# Altium schematic sheet S7CAS-PLEIADES-CARTE-MERE_P02_POWER.SchDoc
size Tabloid; DocumentNumber: 2; SheetNumber: 2; SheetTotal: 14; Size: 11x17; Sheet_Name: Alimentation connecteur FMC
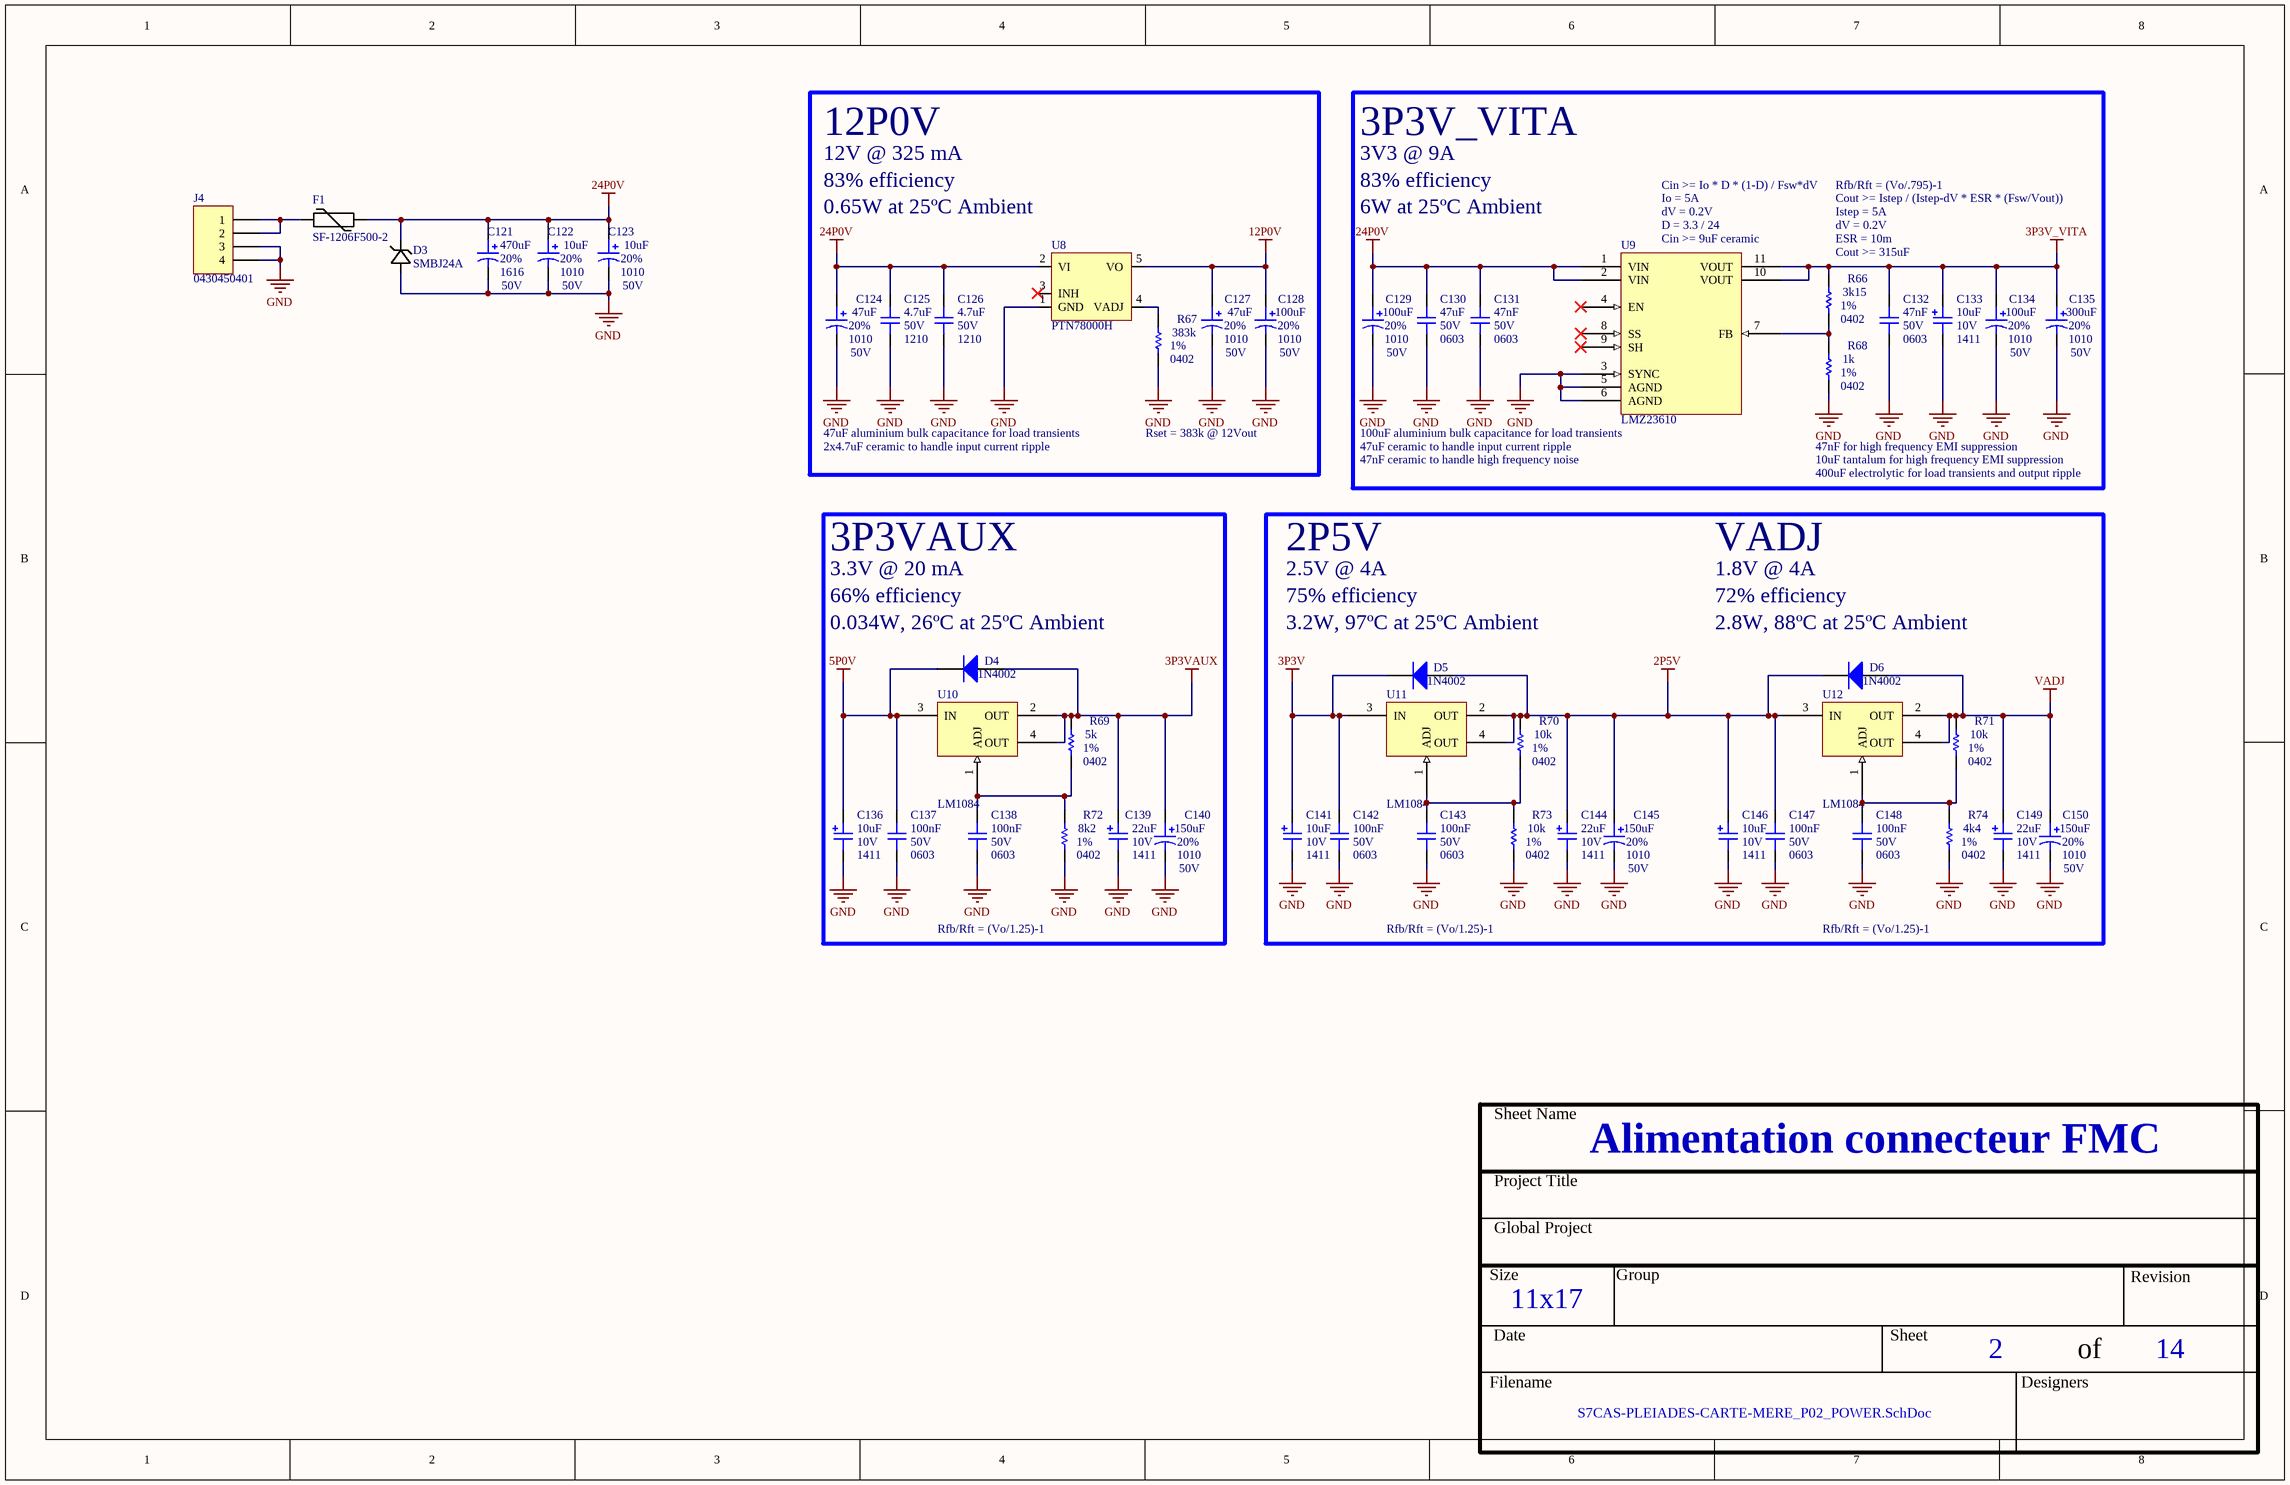
[diagram p0: S7CAS-PLEIADES-CARTE-MERE_P02_POWER.SchDoc]

## Parts
C121  value 470uF  Voltage: 50V  Package: 1616  Precision: 20%  [CAP_ALU_1616_vishay]  (hidden comment: MAL214699108E3)
C122  value 10uF  Voltage: 50V  Package: 1010  Precision: 20%  [CAP_ALU_1010_vishay]  (hidden comment: MAL215099101E3)
C123  value 10uF  Voltage: 50V  Package: 1010  Precision: 20%  [CAP_ALU_1010_vishay]  (hidden comment: MAL215099101E3)
C124  value 47uF  Voltage: 50V  Package: 1010  Precision: 20%  [CAP_ALU_1010_vishay]  (hidden comment: MAL215099101E3)
C125  value 4.7uF  Voltage: 50V  Package: 1210  [CAP_1210]  (hidden comment: CAP - 1210)
C126  value 4.7uF  Voltage: 50V  Package: 1210  [CAP_1210]  (hidden comment: CAP - 1210)
C127  value 47uF  Voltage: 50V  Package: 1010  Precision: 20%  [CAP_ALU_1010_vishay]  (hidden comment: MAL215099101E3)
C128  value 100uF  Voltage: 50V  Package: 1010  Precision: 20%  [CAP_ALU_1010_vishay]  (hidden comment: MAL215099101E3)
C129  value 100uF  Voltage: 50V  Package: 1010  Precision: 20%  [CAP_ALU_1010_vishay]  (hidden comment: MAL215099101E3)
C130  value 47uF  Voltage: 50V  Package: 0603  [CAP_0603]  (hidden comment: CAP - 0603)
C131  value 47nF  Voltage: 50V  Package: 0603  [CAP_0603]  (hidden comment: CAP - 0603)
C132  value 47nF  Voltage: 50V  Package: 0603  [CAP_0603]  (hidden comment: CAP - 0603)
C133  value 10uF  Voltage: 10V  Package: 1411  [CAP_TAN_1411(B)]  (hidden comment: CAP - TANTALUM - CASE B)
C134  value 100uF  Voltage: 50V  Package: 1010  Precision: 20%  [CAP_ALU_1010_vishay]  (hidden comment: MAL215099101E3)
C135  value 300uF  Voltage: 50V  Package: 1010  Precision: 20%  [CAP_ALU_1010_vishay]  (hidden comment: MAL215099101E3)
C136  value 10uF  Voltage: 10V  Package: 1411  [CAP_TAN_1411(B)]  (hidden comment: CAP - TANTALUM - CASE B)
C137  value 100nF  Voltage: 50V  Package: 0603  [CAP_0603]  (hidden comment: CAP - 0603)
C138  value 100nF  Voltage: 50V  Package: 0603  [CAP_0603]  (hidden comment: CAP - 0603)
C139  value 22uF  Voltage: 10V  Package: 1411  [CAP_TAN_1411(B)]  (hidden comment: CAP - TANTALUM - CASE B)
C140  value 150uF  Voltage: 50V  Package: 1010  Precision: 20%  [CAP_ALU_1010_vishay]  (hidden comment: MAL215099101E3)
C141  value 10uF  Voltage: 10V  Package: 1411  [CAP_TAN_1411(B)]  (hidden comment: CAP - TANTALUM - CASE B)
C142  value 100nF  Voltage: 50V  Package: 0603  [CAP_0603]  (hidden comment: CAP - 0603)
C143  value 100nF  Voltage: 50V  Package: 0603  [CAP_0603]  (hidden comment: CAP - 0603)
C144  value 22uF  Voltage: 10V  Package: 1411  [CAP_TAN_1411(B)]  (hidden comment: CAP - TANTALUM - CASE B)
C145  value 150uF  Voltage: 50V  Package: 1010  Precision: 20%  [CAP_ALU_1010_vishay]  (hidden comment: MAL215099101E3)
C146  value 10uF  Voltage: 10V  Package: 1411  [CAP_TAN_1411(B)]  (hidden comment: CAP - TANTALUM - CASE B)
C147  value 100nF  Voltage: 50V  Package: 0603  [CAP_0603]  (hidden comment: CAP - 0603)
C148  value 100nF  Voltage: 50V  Package: 0603  [CAP_0603]  (hidden comment: CAP - 0603)
C149  value 22uF  Voltage: 10V  Package: 1411  [CAP_TAN_1411(B)]  (hidden comment: CAP - TANTALUM - CASE B)
C150  value 150uF  Voltage: 50V  Package: 1010  Precision: 20%  [CAP_ALU_1010_vishay]  (hidden comment: MAL215099101E3)
D3  SMBJ24A  [DO-214AA]
D4  1N4002  [DO-41]
D5  1N4002  [DO-41]
D6  1N4002  [DO-41]
F1  SF-1206F500-2  [RES_1206]
J4  0430450401  [0430450401]
R66  value 3k15  Package: 0402  Precision: 1%  [RES_0402]  (hidden comment: RES - 0402)
R67  value 383k  Package: 0402  Precision: 1%  [RES_0402]  (hidden comment: RES - 0402)
R68  value 1k  Package: 0402  Precision: 1%  [RES_0402]  (hidden comment: RES - 0402)
R69  value 5k  Package: 0402  Precision: 1%  [RES_0402]  (hidden comment: RES - 0402)
R70  value 10k  Package: 0402  Precision: 1%  [RES_0402]  (hidden comment: RES - 0402)
R71  value 10k  Package: 0402  Precision: 1%  [RES_0402]  (hidden comment: RES - 0402)
R72  value 8k2  Package: 0402  Precision: 1%  [RES_0402]  (hidden comment: RES - 0402)
R73  value 10k  Package: 0402  Precision: 1%  [RES_0402]  (hidden comment: RES - 0402)
R74  value 4k4  Package: 0402  Precision: 1%  [RES_0402]  (hidden comment: RES - 0402)
U8  PTN78000H  [PTN78000W]
U9  LMZ23610  [NDY0011A]
U10  LM1084  [DPAK-3]
U11  LM1084  [DPAK-3]
U12  LM1084  [DPAK-3]

## Blocks framed on the sheet
12P0V: C124-C128 R67 U8
3P3V_VITA: C129-C135 R66 R68 U9
3P3VAUX: C136-C140 D4 R69 R72 U10

## Nets
2P5V: C144.2 C145.1 C146.2 C147.2 D5.1(A) D6.2(K) R70.2 U11.2(OUT) U11.4(OUT) U12.3(IN)
3P3V: C141.2 C142.2 D5.2(K) U11.3(IN)
3P3V_VITA: C132.2 C133.2 C134.1 C135.1 R66.2 U9.10(VOUT) U9.11(VOUT)
3P3VAUX: C139.2 C140.1 D4.1(A) R69.2 U10.2(OUT) U10.4(OUT)
5P0V: C136.2 C137.2 D4.2(K) U10.3(IN)
12P0V: C127.1 C128.1 U8.5(VO)
24P0V: C121.1 C122.1 C123.1 C124.1 C125.2 C126.2 C129.1 C130.2 C131.2 D3.1(C) F1.2 U8.2(VI) U9.1(VIN) U9.2(VIN)
GND: C121.2 C122.2 C123.2 C124.2 C125.1 C126.1 C127.2 C128.2 C129.2 C130.1 C131.1 C132.1 C133.1 C134.2 C135.2 C136.1 C137.1 C138.1 C139.1 C140.2 C141.1 C142.1 C143.1 C144.1 C145.2 C146.1 C147.1 C148.1 C149.1 C150.2 D3.2(A) J4.3 J4.4 R67.1 R68.1 R72.1 R73.1 R74.1 U8.1(GND) U9.3(SYNC) U9.5(AGND) U9.6(AGND)
VADJ: C149.2 C150.1 D6.1(A) R71.2 U12.2(OUT) U12.4(OUT)
NetC138_2: C138.2 R69.1 R72.2 U10.1(ADJ)
NetC143_2: C143.2 R70.1 R73.2 U11.1(ADJ)
NetC148_2: C148.2 R71.1 R74.2 U12.1(ADJ)
NetF1_1: F1.1 J4.1 J4.2
NetR66_1: R66.1 R68.2 U9.7(FB)
NetR67_2: R67.2 U8.4(VADJ)

Not connected (* = marked no-connect by the designer): U8 3(INH)*; U9 4(EN)* 8(SS)* 9(SH)*

## Notes on the sheet
- 12V @ 325 mA
- 3V3 @ 9A
- 83% efficiency
- (near U8) 0.65W at 25ºC Ambient
- 6W at 25ºC Ambient
- Cin >= Io * D * (1-D) / Fsw*dV
- Io = 5A
- (near U9) dV = 0.2V
- (near U9) D = 3.3 / 24
- Cout >= Istep / (Istep-dV * ESR * (Fsw/Vout))
- Istep = 5A
- dV = 0.2V
- Rfb/Rft = (Vo/.795)-1
- (near U9) Cin >= 9uF ceramic
- ESR = 10m
- (near R66) Cout >= 315uF
- 47uF aluminium bulk capacitance for load transients
- Rset = 383k @ 12Vout
- (near U9) 100uF aluminium bulk capacitance for load transients
- 2x4.7uF ceramic to handle input current ripple
- (near U9) 47uF ceramic to handle input current ripple
- 47nF ceramic to handle high frequency noise
- 47nF for high frequency EMI suppression
- 10uF tantalum for high frequency EMI suppression
- 400uF electrolytic for load transients and output ripple
- 2P5V
- VADJ
- 3.3V @ 20 mA
- 66% efficiency
- (near D4) 0.034W, 26ºC at 25ºC Ambient
- 2.5V @ 4A
- 75% efficiency
- (near D5) 3.2W, 97ºC at 25ºC Ambient
- 1.8V @ 4A
- 72% efficiency
- (near D6) 2.8W, 88ºC at 25ºC Ambient
- Rfb/Rft = (Vo/1.25)-1
- Sheet Name
- Project Title
- Global Project
- Size
- Group
- Revision
- Date
- Sheet
- of
- Filename
- Designers

## Library data of the parts
C121 = CAP_ALU_MAL214699108E3: CAP - ALU 470uF 20% 50V - 1616; Current: 1.3A; Mfg: Vishay Dale; Mfg Part Number: MAL214699108E3; HelpURL: http://www.vishay.com/docs/28403/146cti.pdf; CreatedBy: Jonathan Bouchard; Temperature: -55°C to 125°C; Power: *; Supplier 1: Digikey; Supplier Part Number 1: 4442PHCT-ND
C122 C123 C128 C129 C134 C135 C140 C145 C150 = CAP_ALU_MAL215099101E3: CAP - ALU 100uF 20% 50V - 1010; Current: 490mA; Mfg: Vishay Dale; Mfg Part Number: MAL215099101E3; HelpURL: http://www.vishay.com/docs/28395/150crz.pdf; CreatedBy: Jonathan Bouchard; Temperature: -55°C to 125°C; Power: *; Supplier 1: Digikey; Supplier Part Number 1: 4399PHDKR-ND
C124 C127 = CAP_ALU_MAL215099101E3: CAP - ALU 47uF 20% 50V - 1010; Current: 490mA; Mfg: Vishay Dale; Mfg Part Number: MAL215099101E3; HelpURL: http://www.vishay.com/docs/28395/150crz.pdf; CreatedBy: Jonathan Bouchard; Temperature: -55°C to 125°C; Power: *; Supplier 1: Digikey; Supplier Part Number 1: 4399PHDKR-ND
C125 C126 = CAP - 1210: Precision: 10%; Current: *; CreatedBy: Jonathan Bouchard; Power: *
C130-C132 C137 C138 C142 C143 C147 C148 = CAP - 0603: Precision: 10%; Current: *; CreatedBy: Jonathan Bouchard; Power: *
C133 C136 C139 C141 C144 C146 C149 = CAP_TANT_1411(B): CAP - TANTALUM - 1411; Precision: 10%; Current: *; CreatedBy: Jonathan Bouchard; Power: *
D3 = SMBJ24A: Vf: 24V; Imax: 15.5A; Pd: 600W
D4-D6 = Diode 1N4002: 1 Amp General Purpose Rectifier; Published: 8-Jun-2000; LatestRevisionDate: 17-Jul-2002; LatestRevisionNote: Re-released for DXP Platform.; DatasheetVersion: 1998; PackageVersion: Aug-1999; PackageReference: DO-41; Publisher: Altium Limited; PackageDescription: Diode, Axial; Body 5.2 x 2.7 mm (LxDia. max), Lead Dia. 0.86 mm (max); Code_JEDEC: DO-204-AL; ComponentLink1Description: Manufacturer Link; ComponentLink1URL: http://www.fairchildsemi.com/; ComponentLink2Description: Datasheet; ComponentLink2URL: http://www.fairchildsemi.com/ds/1N%2F1N4001.pdf
F1 = SF-1206F500-2: Manufacturer: Bourns Inc.; Itrip: 5A; Voltage: 24V; Footprint: 1206; Part Number: SF-1206F500-2
J4 = Header 4: Header, 4-Pin; Manufacturer: Molex; Imax: 8A; LatestRevisionDate: 17-Jul-2002; LatestRevisionNote: Re-released for DXP Platform.; Publisher: Altium Limited; Part Number: 0430450401
R66 R68-R74 = RES - 0402: Voltage: 50V; Power: 1/16W; Current: *; CreatedBy: Jonathan Bouchard
R67 = RES - 0402: RES - 0402 - 1/16W; Voltage: 50V; Current: *; CreatedBy: Jonathan Bouchard; Power: 1/16W
U8 = PTN78000H: XXX - 1.5-A, / WIDE-INPUT / ADJUSTABLE / SWITCHING / REGULATOR - Package; GRAMS Lib Spec: 2.7